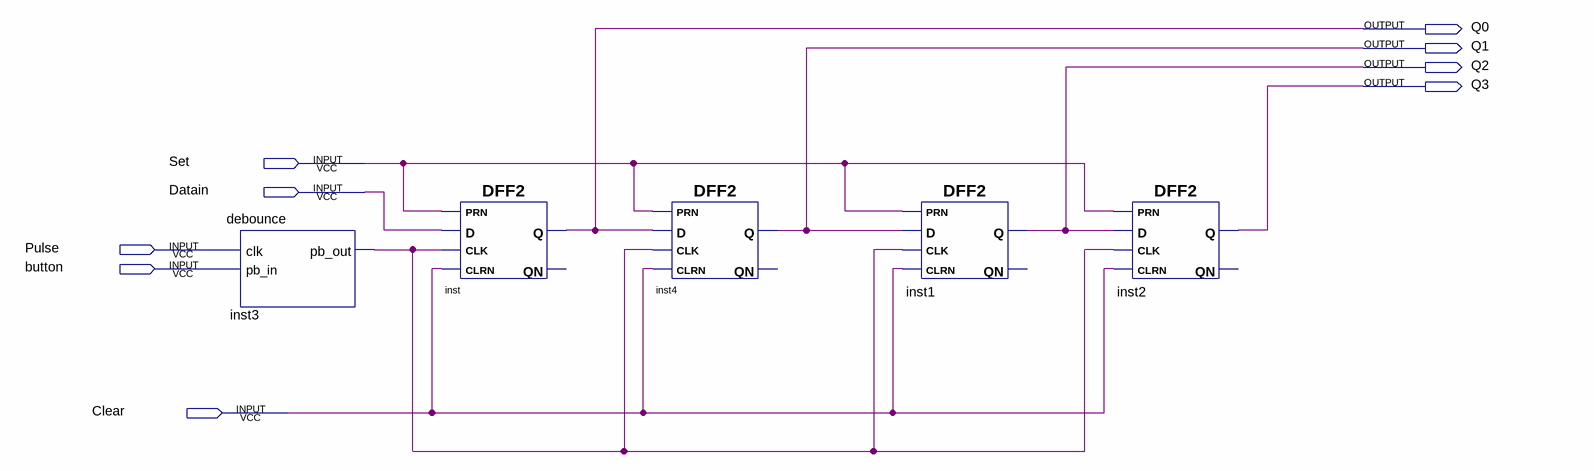
[diagram p0: schematic sheet]
// Quartus schematic Shift_register.bdf as structural Verilog: 5 symbols, 9 pins
module Shift_register (
  input  Set,
  input  Datain,
  input  Pulse,
  input  button,
  input  Clear,
  output Q0,
  output Q1,
  output Q2,
  output Q3
);

  wire inst3_pb_out;

  debounce inst3 (.clk(Pulse), .pb_in(button), .pb_out(inst3_pb_out));
  DFF2 inst (.CLK(inst3_pb_out), .D(Datain), .PRN(Set), .CLRN(Clear), .Q(Q0));  // open: QN
  DFF2 inst4 (.CLK(inst3_pb_out), .D(Q0), .PRN(Set), .CLRN(Clear), .Q(Q1));  // open: QN
  DFF2 inst1 (.CLK(inst3_pb_out), .D(Q1), .PRN(Set), .CLRN(Clear), .Q(Q2));  // open: QN
  DFF2 inst2 (.CLK(inst3_pb_out), .D(Q2), .PRN(Set), .CLRN(Clear), .Q(Q3));  // open: QN
endmodule
